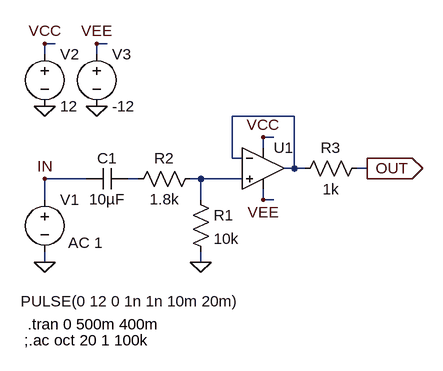
[diagram p0: schematic Sub_Osc_Out_Buff.asc]
Sub_Osc_Out_Buff.asc, the LTspice schematic file:
Version 4
SHEET 1 880 680
WIRE 144 -112 128 -112
WIRE 224 -112 208 -112
WIRE 128 -96 128 -112
WIRE 208 -96 208 -112
WIRE 512 0 416 0
WIRE 480 32 464 32
WIRE 464 48 464 32
WIRE 416 64 416 0
WIRE 432 64 416 64
WIRE 512 80 512 0
WIRE 512 80 496 80
WIRE 528 80 512 80
WIRE 624 80 608 80
WIRE 192 96 128 96
WIRE 272 96 256 96
WIRE 368 96 352 96
WIRE 432 96 368 96
WIRE 128 128 128 96
WIRE 368 128 368 96
WIRE 464 128 464 112
WIRE 480 128 464 128
WIRE 128 224 128 208
WIRE 368 224 368 208
FLAG 128 224 0
FLAG 128 -16 0
FLAG 208 -16 0
FLAG 128 -112 VCC
FLAG 208 -112 VEE
FLAG 624 80 OUT
IOPIN 624 80 Out
FLAG 368 224 0
FLAG 464 32 VCC
FLAG 464 128 VEE
FLAG 128 96 IN
SYMBOL voltage 128 112 R0
WINDOW 3 -37 172 Left 2
WINDOW 123 36 82 Left 2
WINDOW 39 0 0 Left 0
SYMATTR InstName V1
SYMATTR Value PULSE(0 12 0 1n 1n 10m 20m)
SYMATTR Value2 AC 1
SYMBOL voltage 128 -112 R0
WINDOW 123 0 0 Left 0
WINDOW 39 0 0 Left 0
SYMATTR InstName V2
SYMATTR Value 12
SYMBOL voltage 208 -112 R0
WINDOW 123 0 0 Left 0
WINDOW 39 0 0 Left 0
SYMATTR InstName V3
SYMATTR Value -12
SYMBOL cap 256 80 R90
WINDOW 0 0 32 VBottom 2
WINDOW 3 32 32 VTop 2
SYMATTR InstName C1
SYMATTR Value 10µF
SYMBOL res 352 112 R0
SYMATTR InstName R1
SYMATTR Value 10k
SYMBOL res 368 80 R90
WINDOW 0 0 56 VBottom 2
WINDOW 3 32 56 VTop 2
SYMATTR InstName R2
SYMATTR Value 1.8k
SYMBOL Opamps\\UniversalOpamp2 464 80 R0
SYMATTR InstName U1
SYMBOL res 624 64 R90
WINDOW 0 0 56 VBottom 2
WINDOW 3 32 56 VTop 2
SYMATTR InstName R3
SYMATTR Value 1k
TEXT 102 320 Left 2 !.tran 0 500m 400m
TEXT 96 344 Left 2 !;.ac oct 20 1 100k

The netlist it stands for:
* Sub_Osc_Out_Buff.asc
V1 IN 0 PULSE(0 12 0 1n 1n 10m 20m) AC 1
V2 VCC 0 12
V3 VEE 0 -12
C1 N002 IN 10µF
R1 N003 0 10k
R2 N003 N002 1.8k
XU1 N003 N001 VCC VEE N001 level.2 Avol=1Meg GBW=10Meg Slew=10Meg ilimit=25m rail=0 Vos=0 phimargin=45 en=0 enk=0 in=0 ink=0 Rin=500Meg  ; pins IN+ IN- V+ V- OUT
R3 OUT N001 1k
.tran 0 500m 400m
;.ac oct 20 1 100k
.lib UniversalOpamps2.sub
.backanno
.end